# EAGLE schematic Wiring (EAGLE 8.3.2)
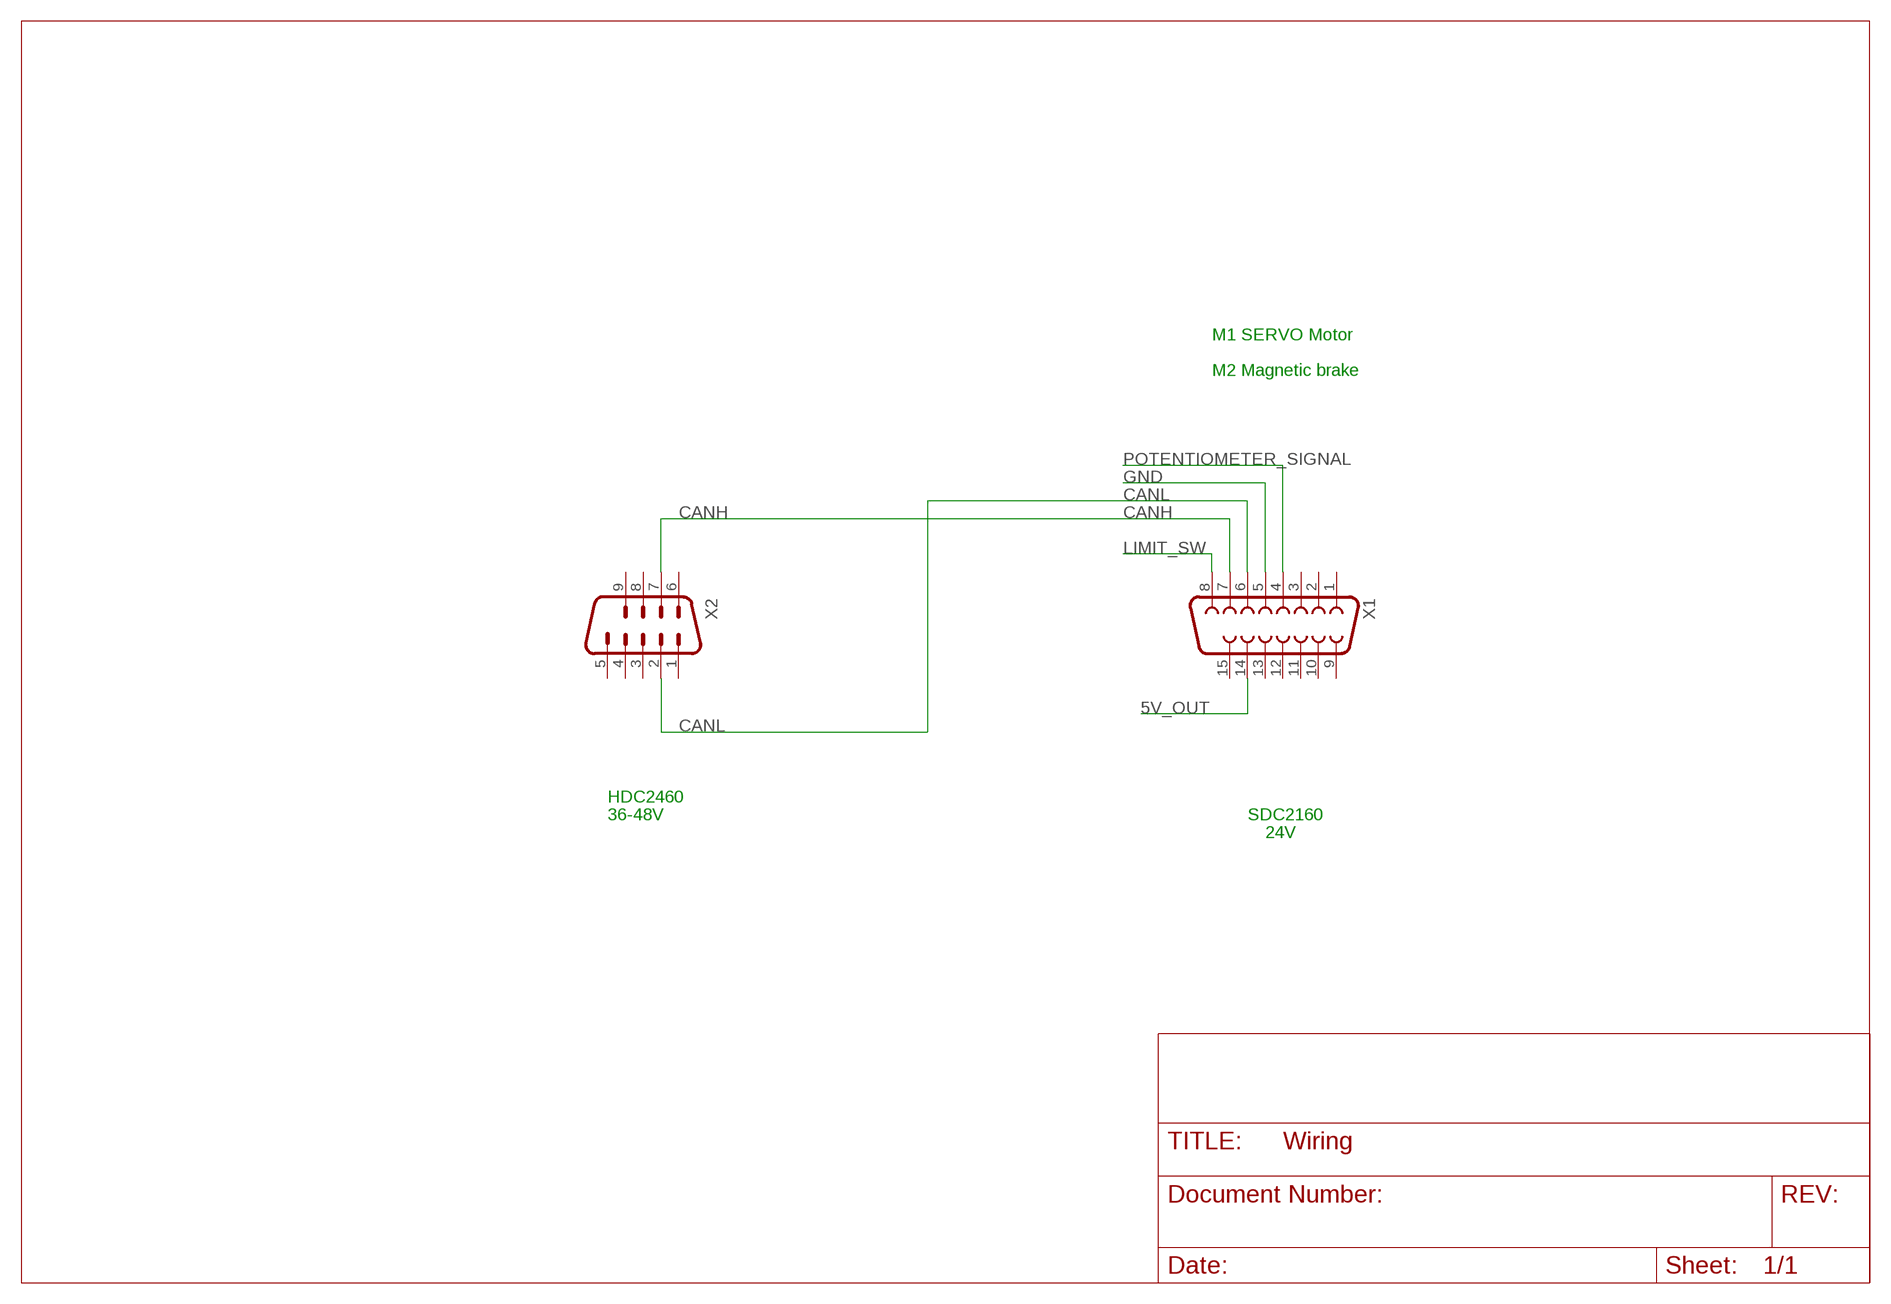
[diagram p0: schematic, sheet 1]

## Parts
X1  F15V  [F15V]
X2  M09-182  [182-009-MALE]

## Nets
5V_OUT: X1.14
CANH: X1.7 X2.7
CANL: X1.6 X2.2
GND: X1.5
LIMIT_SW: X1.8
POTENTIOMETER_SIGNAL: X1.4
Unconnected: X1.1 X1.2 X1.3 X1.9 X1.10 X1.11 X1.12 X1.13 X1.15 X2.1 X2.3 X2.4 X2.5 X2.6 X2.8 X2.9

## Notes on the sheet
- M1 SERVO Motor
- M2 Magnetic brake
- HDC2460
- 36-48V | SDC2160
- 24V

## Library data of the parts
X1 = con-subd:F15: SUB-D; OC_FARNELL: unknown; OC_NEWARK: unknown
X2 = con-subd:M09: SUB-D; OC_FARNELL: unknown; OC_NEWARK: unknown